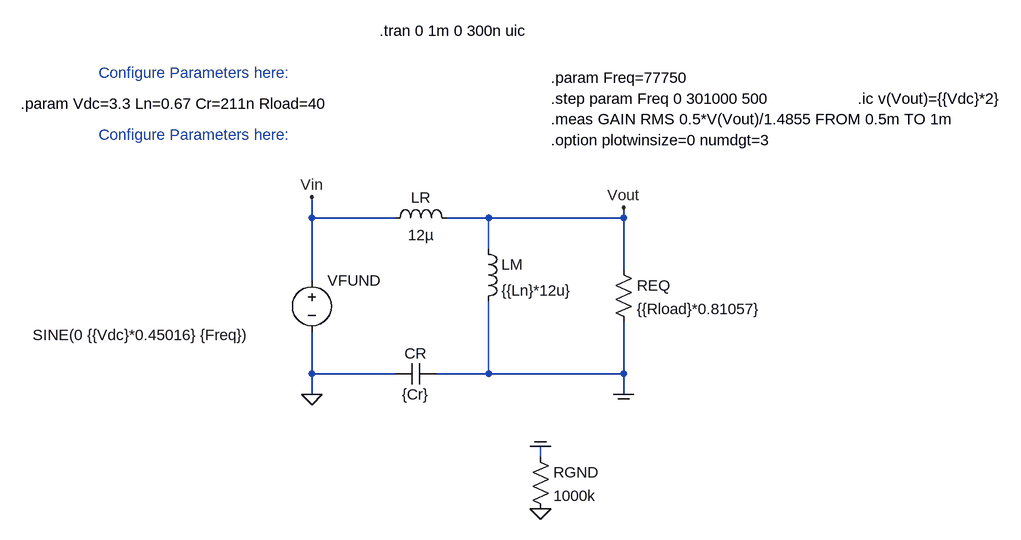
[diagram p0: schematic Resonant-FHA.asc]
Resonant-FHA.asc, the LTspice schematic file:
Version 4
SHEET 1 1584 680
WIRE 32 16 32 -16
WIRE 160 16 32 16
WIRE 304 16 240 16
WIRE 512 16 512 0
WIRE 512 16 304 16
WIRE 304 64 304 16
WIRE 512 96 512 16
WIRE 32 112 32 16
WIRE 32 256 32 192
WIRE 160 256 32 256
WIRE 304 256 304 144
WIRE 304 256 224 256
WIRE 512 256 512 176
WIRE 512 256 304 256
WIRE 32 288 32 256
WIRE 512 288 512 256
WIRE 384 384 384 368
FLAG 32 288 0
FLAG 32 -16 Vin
FLAG 512 0 Vout
FLAG 512 288 COM
FLAG 384 464 0
FLAG 384 368 COM
SYMBOL cap 224 240 R90
WINDOW 0 0 32 VBottom 2
WINDOW 3 32 32 VTop 2
SYMATTR InstName CR
SYMATTR Value {Cr}
SYMBOL ind 144 32 R270
WINDOW 0 32 56 VTop 2
WINDOW 3 5 56 VBottom 2
SYMATTR InstName LR
SYMATTR Value 12µ
SYMATTR SpiceLine Ipk=8.2 Rser=0.02 Rpar=3150 Cpar=9.5p
SYMBOL ind 288 48 R0
SYMATTR InstName LM
SYMATTR Value {{Ln}*12u}
SYMATTR SpiceLine Ipk=8.2 Rser=0.02 Rpar=3150 Cpar=9.5p
SYMBOL res 496 80 R0
SYMATTR InstName REQ
SYMATTR Value {{Rload}*0.81057}
SYMBOL voltage 32 96 R0
WINDOW 123 0 0 Left 0
WINDOW 39 0 0 Left 0
WINDOW 3 -430 100 Left 2
SYMATTR Value SINE(0 {{Vdc}*0.45016} {Freq})
SYMATTR InstName VFUND
SYMBOL res 368 368 R0
SYMATTR InstName RGND
SYMATTR Value 1000k
TEXT 400 -168 Left 2 !.step param Freq 0 301000 500
TEXT 136 -272 Left 2 !.tran 0 1m 0 300n uic
TEXT 400 -136 Left 2 !.meas GAIN RMS 0.5*V(Vout)/1.4855 FROM 0.5m TO 1m
TEXT 400 -104 Left 2 !.option plotwinsize=0 numdgt=3
TEXT 872 -168 Left 2 !.ic v(Vout)={{Vdc}*2}
TEXT 400 -200 Left 2 !.param Freq=77750
TEXT -296 -208 Left 2 ;Configure Parameters here:
TEXT -296 -112 Left 2 ;Configure Parameters here:
TEXT -416 -160 Left 2 !.param Vdc=3.3 Ln=0.67 Cr=211n Rload=40

The netlist it stands for:
* Resonant-FHA.asc
CR COM 0 {Cr}
LR Vin Vout 12µ Ipk=8.2 Rser=0.02 Rpar=3150 Cpar=9.5p
LM Vout COM {{Ln}*12u} Ipk=8.2 Rser=0.02 Rpar=3150 Cpar=9.5p
REQ Vout COM {{Rload}*0.81057}
VFUND Vin 0 SINE(0 {{Vdc}*0.45016} {Freq})
RGND COM 0 1000k
.step param Freq 0 301000 500
.tran 0 1m 0 300n uic
.meas GAIN RMS 0.5*V(Vout)/1.4855 FROM 0.5m TO 1m
.option plotwinsize=0 numdgt=3
.ic v(Vout)={{Vdc}*2}
.param Freq=77750
* Configure Parameters here:
* Configure Parameters here:
.param Vdc=3.3 Ln=0.67 Cr=211n Rload=40
.backanno
.end